# EAGLE design espi (EAGLE 7.2.0)
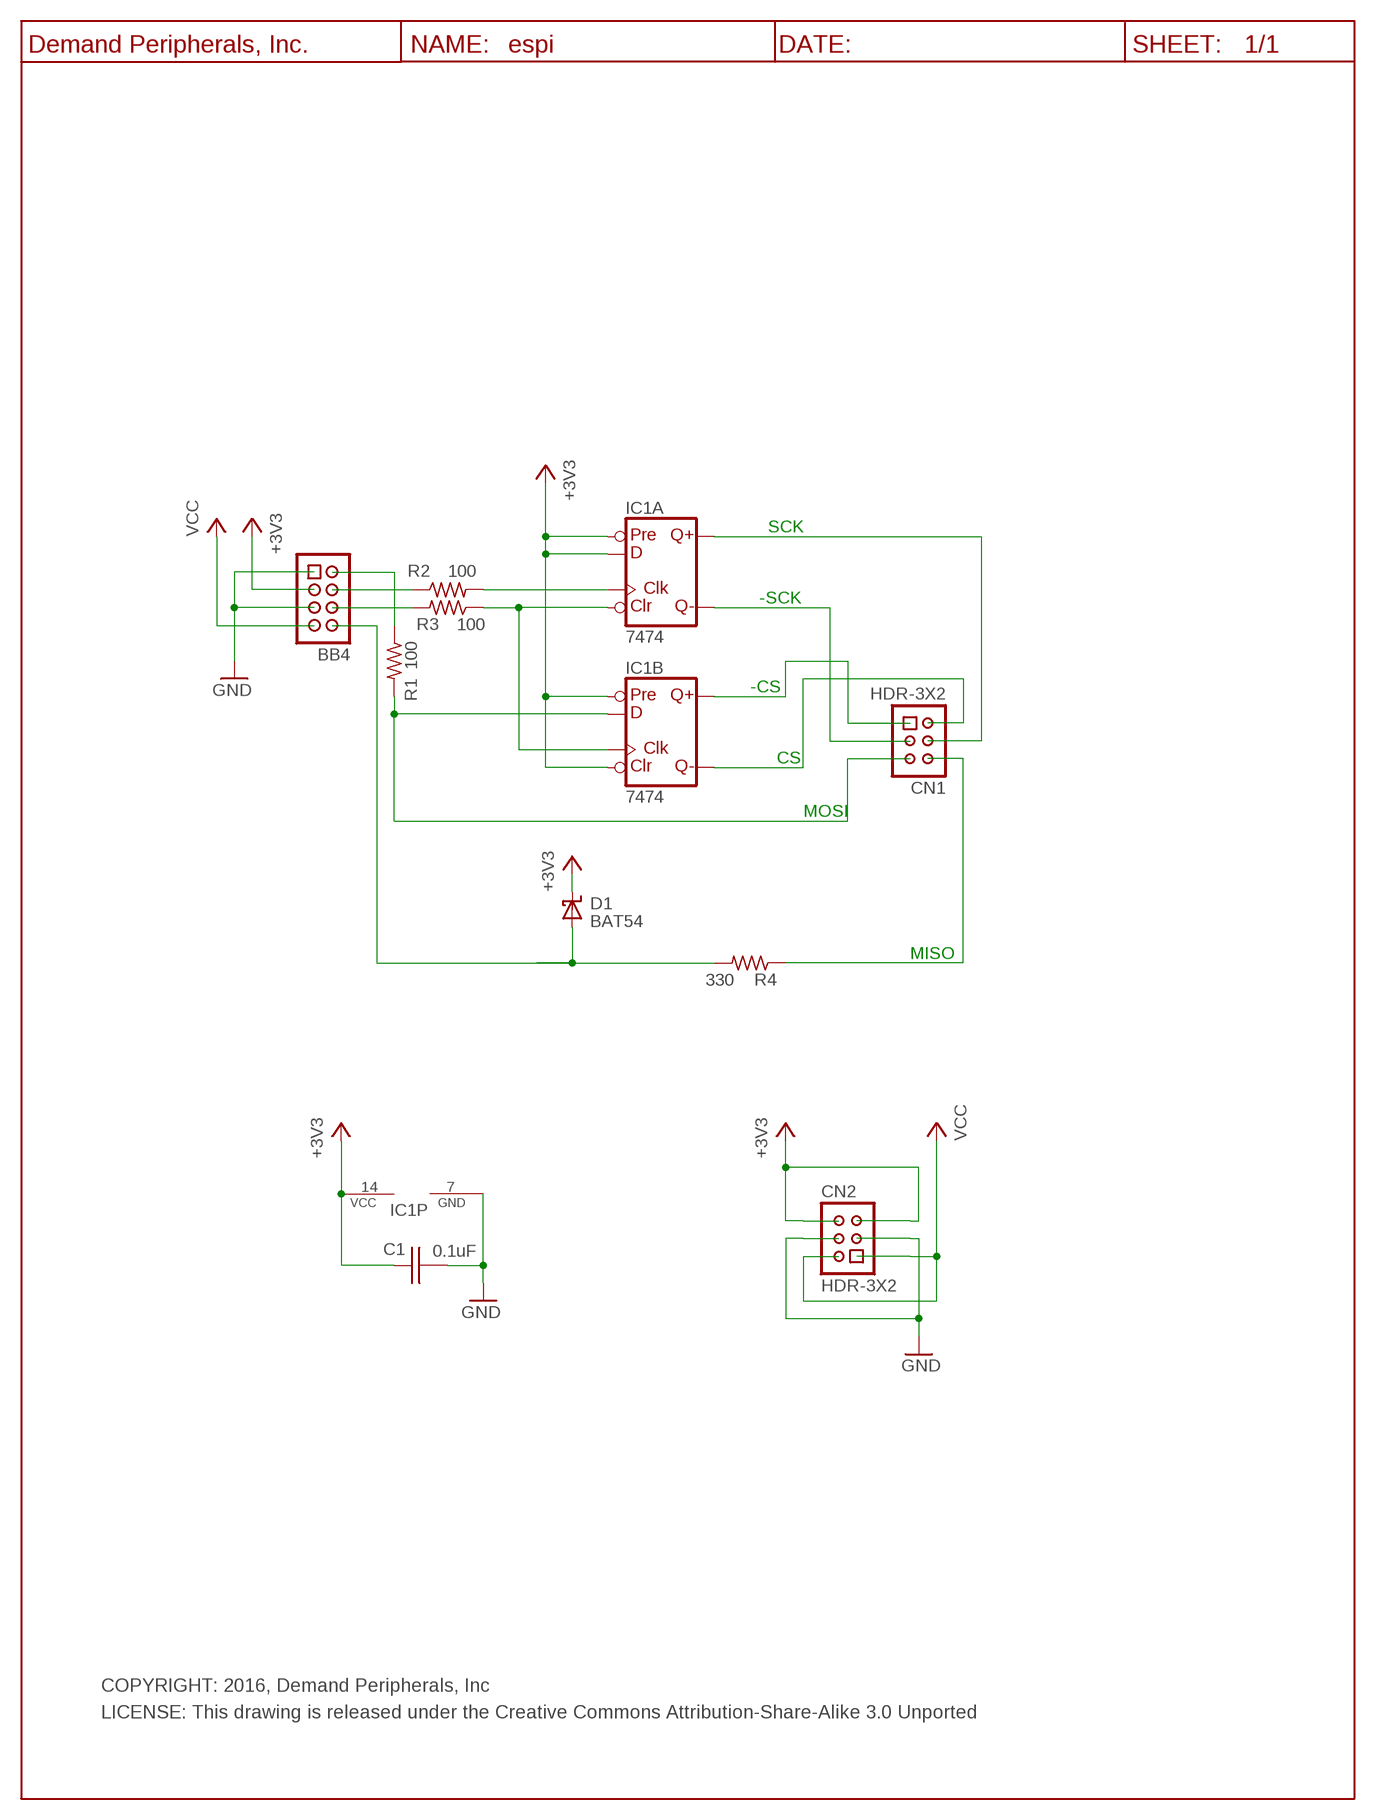
[diagram p0: schematic, sheet 1]

## Parts
BB4  BB_CON  HDR-4X2-SHR  [HDR-4X2]
C1  0.1uF  C0.1UF_C0603  [C0603]
CN1  HDR-3X2  [HDR-3X2]
CN2  HDR-3X2  [HDR-3X2]
D1  BAT54  [SOT23]
IC1  7474  74AHC74SS  [SO14]
R1  100  R100_R0603  [R0603]
R2  100  R100_R0603  [R0603]
R3  100  R100_R0603  [R0603]
R4  330  R330_R0603  [R0603]
U$3  DP_FRAME_P  [P_FRAME]

## Nets
+3V3: BB4.3 C1.1 CN2.5 CN2.6 D1.3(CC) IC1.2(A:D) IC1.4(A:PRE) IC1.10(B:PRE) IC1.13(B:CLR) IC1.14(P:VCC)
GND: BB4.1 BB4.5 C1.2 CN2.3 CN2.4 IC1.7(P:GND)
N$1: CN1.2 IC1.8(B:!Q)
N$2: BB4.8 D1.1(A) R4.2
N$4: CN1.1 IC1.9(B:Q)
N$5: CN1.4 IC1.5(A:Q)
N$6: CN1.3 IC1.6(A:!Q)
N$7: CN1.6 R4.1
N$13: IC1.1(A:CLR) IC1.11(B:CLK) R3.1
N$14: BB4.4 R2.1
N$15: CN1.5 IC1.12(B:D) R1.2
N$16: IC1.3(A:CLK) R2.2
N$19: BB4.6 R3.2
N$20: BB4.2 R1.1
VCC: BB4.7 CN2.1 CN2.2

## Notes on the sheet
- SCK
- -SCK
- -CS
- CS
- MOSI
- MISO
- COPYRIGHT: 2016, Demand Peripherals, Inc
- LICENSE: This drawing is released under the Creative Commons Attribution-Share-Alike 3.0 Unported

## Library data of the parts
BB4 = dpi-conn:HDR-4X2-SHR: Shrouded 4x2 pin header; VENDOR: Digikey; VENDOR-PART-NUM: 609-3530-ND
C1 = dpi-passive:C0.1UF_: 0.1 uF Capacitor, 25V, X7R; VENDOR: Digikey; VENDOR-PART-NUM: 1276-1126-2-ND
CN1 CN2 = dpi-conn:HDR-3X2: Unshrouded 3x2 header with 0.1 inch pitch; VENDOR: Digikey; VENDOR-PART-NUM: 952-2120-ND
D1 = dpi-diopto:BAT54: Schottky Diode; VENDOR: Digikey; VENDOR-PART-NUM: DB3Y313KELCT-ND
IC1 = dpi-transic:74AHC74: Dual D type positive edge triggered FLIP FLOP, preset and clear; VENDOR: Digikey; VENDOR-PART-NUM: 568-4458-1-ND
R1-R3 = dpi-passive:R100_: 100 Ohm resistor, 1%, 0.1 watt; VENDOR: Digikey; VENDOR-PART-NUM: 311-100HRTR-ND
R4 = dpi-passive:R330_: 330 Ohm resistor, 1%, 0.1 watt; VENDOR: Digikey; VENDOR-PART-NUM: 311-330HRTR-ND
U$3 = dpi-sym:DP_FRAME_P: Portrait/Letter Document Frame

## Board
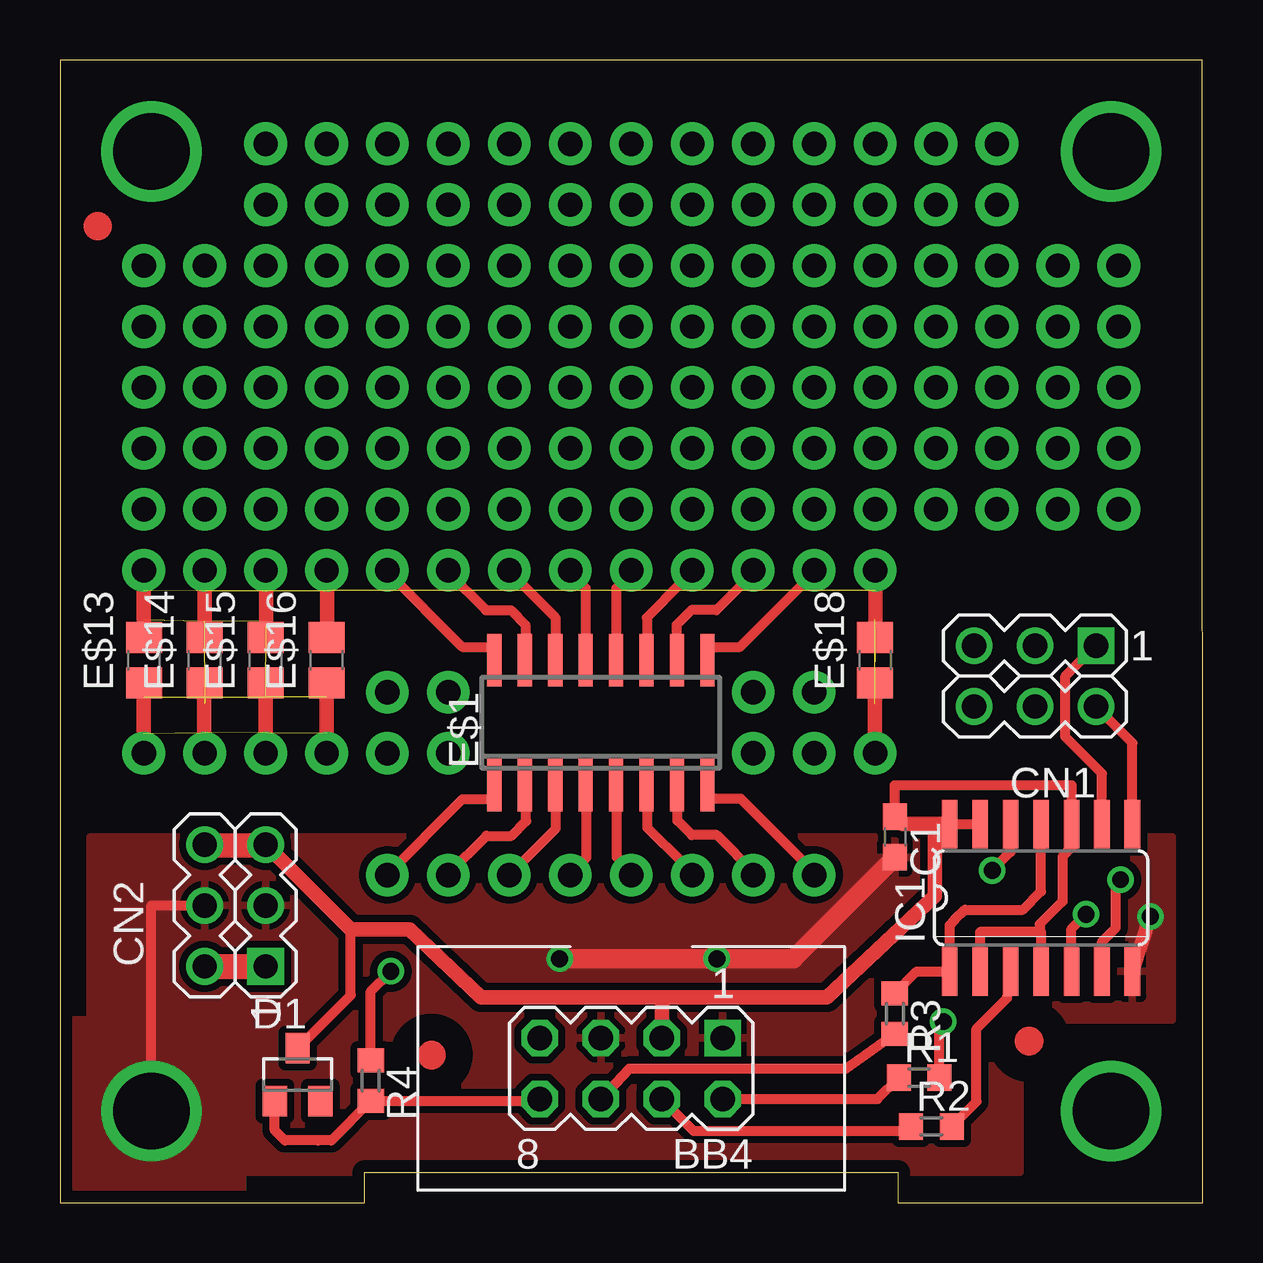
[diagram p1: board, top side]
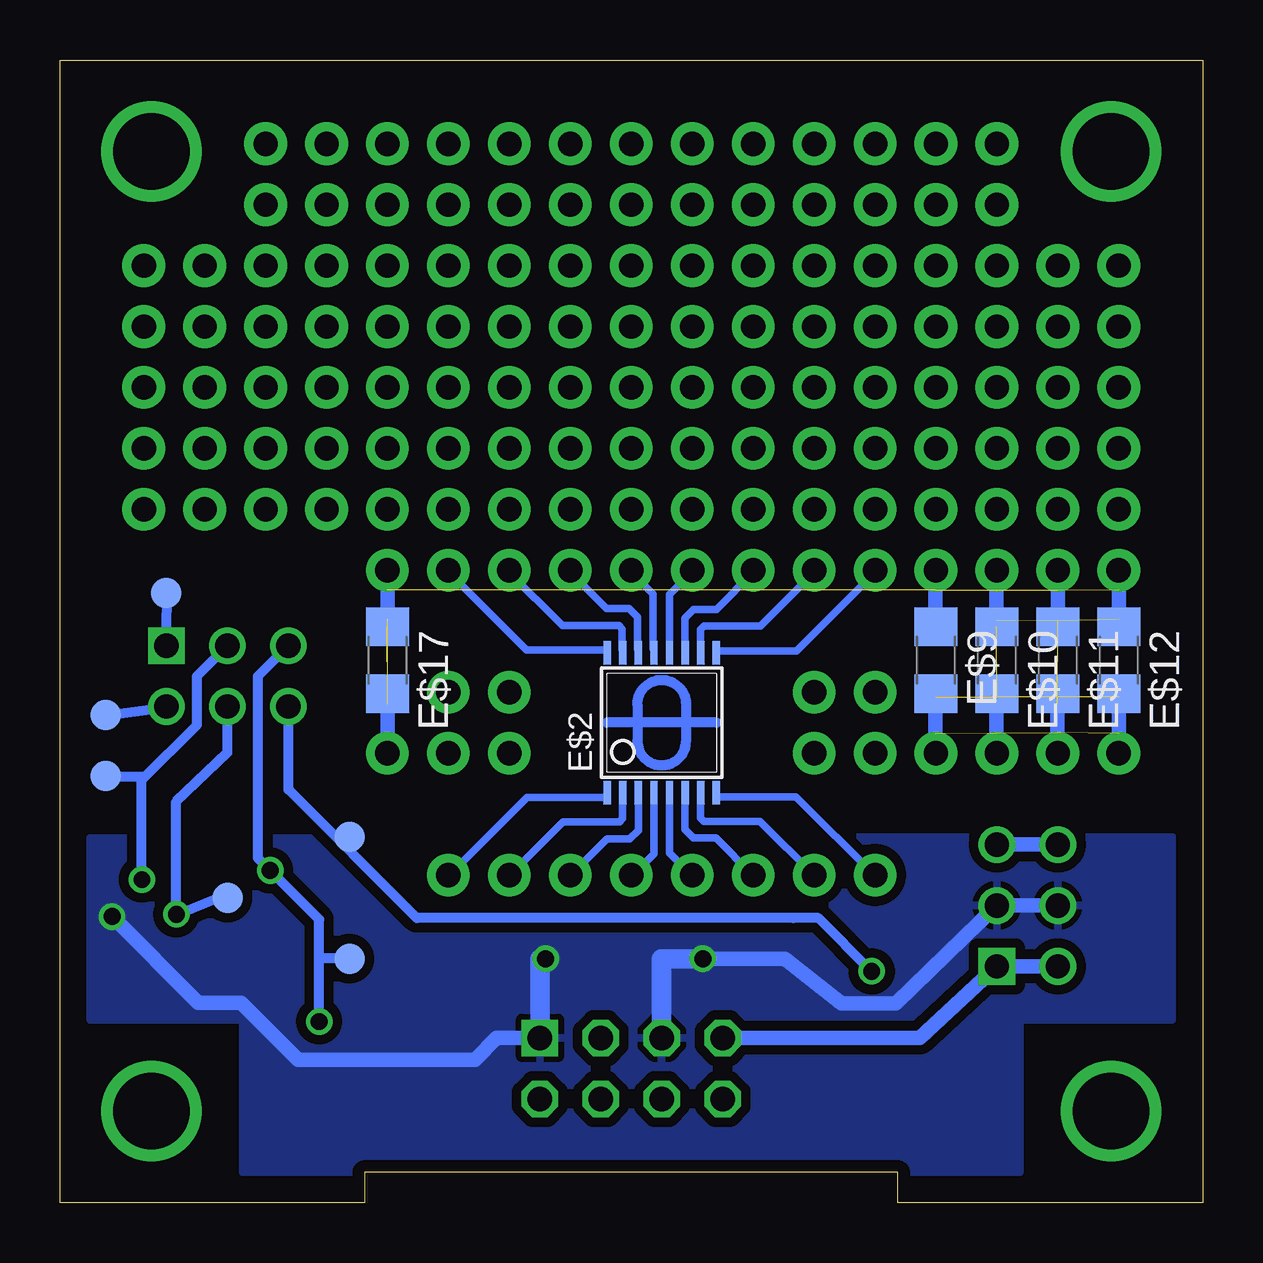
[diagram p2: board, bottom side, seen from below]

Size 47.62 x 47.62 mm. Coordinates in mm from the lower left corner, seen from the top.
Outline: 0,0 12.7,0 12.7,1.27 34.92,1.27 34.92,0 47.62,0 47.61,47.62 0,47.62 0,0
Copper layers (1*16): Top 0.035mm / dielectric 1.5mm / Bottom 0.035mm
Design rules "default *": minimum track width 10mil, minimum drill 24mil, track to track 12mil, track to pad 12mil, pad to pad 12mil, via to via 12mil, smd to smd 10mil, copper to edge 20mil, drill to drill 12mil, minimum pad ring 10mil, minimum via ring 8mil, stop-mask expansion 4mil, vias tented up to drill 29mil, thermal gap 10mil
tKeepout: area 15.1,1 to 32.5,9.7

### Footprints (pad centres in the part's own frame; a part is rotated, then mirrored left to right if it is on the bottom)
HDR-4X2 = drill 1.016 square: 1 -3.81,-1.27 | drill 1.016 octagon: 2 -3.81,1.27; 3 -1.27,-1.27; 4 -1.27,1.27; 5 1.27,-1.27; 6 1.27,1.27; 7 3.81,-1.27; 8 3.81,1.27
C0603 = smd 1.1 x 1: 1 -0.85,0; 2 0.85,0
HDR-3X2 = drill 1.016 square: 1 -2.54,-1.27 | drill 1.016: 2 -2.54,1.27; 3 0,-1.27; 4 0,1.27; 5 2.54,-1.27; 6 2.54,1.27
SOT23 = smd 1.016 x 1.27: 1 -0.95,-1.1; 2 0.95,-1.1; 3 0,1.1
SO16 = smd 0.6 x 2.2: 1 -4.445,-2.6; 2 -3.175,-2.6; 3 -1.905,-2.6; 4 -0.635,-2.6; 5 0.635,-2.6; 6 1.905,-2.6; 7 3.175,-2.6; 8 4.445,-2.6; 9 4.445,2.6; 10 3.175,2.6; 11 1.905,2.6; 12 0.635,2.6; 13 -0.635,2.6; 14 -1.905,2.6; 15 -3.175,2.6; 16 -4.445,2.6
TSSOP16 = smd 0.305 x 0.991: 1 -2.275,-2.918; 2 -1.625,-2.918; 3 -0.975,-2.918; 4 -0.325,-2.918; 5 0.325,-2.918; 6 0.975,-2.918; 7 1.625,-2.918; 8 2.275,-2.918; 9 2.275,2.918; 10 1.625,2.918; 11 0.975,2.918; 12 0.325,2.918; 13 -0.325,2.918; 14 -0.975,2.918; 15 -1.625,2.918; 16 -2.275,2.918
TEST-POINT = smd 1.27 x 1.27: P1 0,0
C1206 = smd 1.6 x 1.8: 1 -1.4,0; 2 1.4,0
C0805 = smd 1.3 x 1.5: 1 -0.95,0; 2 0.95,0
SO14 = smd 0.66 x 2.032: 1 -3.81,-3.073; 2 -2.54,-3.073; 3 -1.27,-3.073; 4 0,-3.073; 5 1.27,-3.073; 6 2.54,-3.073; 7 3.81,-3.073; 8 3.81,3.073; 9 2.54,3.073; 10 1.27,3.073; 11 0,3.073; 12 -1.27,3.073; 13 -2.54,3.073; 14 -3.81,3.073
R0603 = smd 1 x 1.1: 1 -0.85,0; 2 0.85,0

### Placement (x,y rotation side)
BB4  23.81,5.59 180 top
C1  34.8,15.24 270 top
CN1  40.64,21.95 180 top
CN2  7.3,12.38 90 top
D1  9.91,5.33 0 top
E$1  [SO16]  22.54,20 0 top
E$2  [TSSOP16]  22.54,20 0 bottom
E$3  [TEST-POINT]  45.72,17.78 0 bottom
E$4  [TEST-POINT]  35.56,10.16 0 bottom
E$5  [TEST-POINT]  35.56,15.24 0 bottom
E$6  [TEST-POINT]  40.64,12.7 0 bottom
E$7  [TEST-POINT]  43.19,25.4 0 bottom
E$8  [TEST-POINT]  45.72,20.32 0 bottom
E$9  [C1206]  11.11,22.61 270 bottom
E$10  [C1206]  8.57,22.61 270 bottom
E$11  [C1206]  6.03,22.61 270 bottom
E$12  [C1206]  3.49,22.61 270 bottom
E$13  [C0805]  3.51,22.61 90 top
E$14  [C0805]  6.03,22.61 90 top
E$15  [C0805]  8.57,22.61 90 top
E$16  [C0805]  11.11,22.61 90 top
E$17  [C1206]  33.97,22.61 270 bottom
E$18  [C0805]  33.97,22.61 90 top
IC1  40.89,12.7 0 top
R1  35.81,5.21 0 top
R2  36.32,3.17 0 top
R3  34.8,7.87 270 top
R4  12.95,5.08 270 top
U$1  [DPI-1]  22.54,20 270 bottom
U$3  -2.54,-2.54 0 top
U$4  [FIDUCIAL]  15.49,6.15 0 top
U$5  [FIDUCIAL]  40.4,6.73 0 top
U$6  [FIDUCIAL]  1.57,40.7 0 top

### Tracks (layer width: path | path; a pad name or v marks a point on that pad's centre or on a via)
+3V3
  Top 0.406: IC1.2 38.35,11.28 40.84,11.28 | 40.84,11.28 40.89,11.28 IC1.4 | C1.1 34.8,17.4 42.16,17.4 IC1.10 42.16,14.8 41.78,14.41 41.78,12.55 40.84,11.61 40.84,11.28 | IC1.14 IC1.13 | 12.12,11.38 12.12,8.64 D1.3
  Top 0.61: C1.1 35.12,15.77 IC1.14 36.47,15.77 36.47,12.79 31.97,8.56 25.11,8.56 | 25.11,8.56 BB4.3 | 25.11,8.56 17.55,8.56 14.57,11.38 12.12,11.38 CN2.5
  Bottom 0.61: CN2.5 CN2.6
GND  (via drill 0.7, 3.17 pad 3.17)
  Top 0.406: CN2.4 3.81,12.38 v3.81,3.81
  Top 0.61: v45.45,11.93 IC1.7
  Top 0.813: C1.2 30.57,10.16 v27.38,10.16 v20.83,10.16
  Bottom 0.61: v45.45,11.93 41.86,8.33 40.08,8.33 39.37,7.62 37.71,5.96 30.33,5.96 29.43,6.86 BB4.1 | CN2.4 CN2.3 12.78,8.29 15.06,8.29 17.4,10.16 v20.83,10.16
  Bottom 0.813: BB4.1 27.62,10.16 v27.38,10.16 | BB4.5 22.54,10.16 v20.83,10.16
  pour Bottom (isolate 0.406): 1.27,15.24 25.4,15.24 46.35,15.2 46.35,7.62 40.01,7.62 40.01,1.27 8.05,1.26 7.62,1.27 7.62,7.62 1.27,7.62
  pour Top (isolate 0.305): 1.27,15.24 46.35,15.24 46.35,7.62 40.01,7.62 40.01,1.27 7.62,1.27 7.62,0.51 0.51,0.51 0.51,7.62 1.27,7.62
MOUNT  (via drill 3.17 pad 3.17)
  other vias: 43.81,43.81
N$1
  Top 0.406: IC1.8 44.7,19.15 CN1.2
N$2
  Top 0.406: BB4.8 19.58,4.23 R4.2 | R4.2 | R4.2 11.31,2.59 10.74,2.59 9.37,2.59 8.98,2.98 8.96,3.01 D1.1
N$4
  Top 0.406: CN1.1 41.91,21.95 41.91,19.41 43.43,17.88 IC1.9
N$5  (via drill 0.7)
  Top 0.406: IC1.5 42.16,11.4 v42.77,12.01
  Bottom 0.406: v42.77,12.01 42.77,16.71 41.52,17.92 40.64,18.76 CN1.4
N$6  (via drill 0.7)
  Top 0.406: IC1.6 43.43,10.87 44.01,11.44 44.01,13.26 v44.21,13.46
  Bottom 0.406: v44.21,13.46 44.21,17.61 41.91,19.91 41.91,21.95 CN1.3
N$7  (via drill 0.7)
  Top 0.406: R4.1 12.95,8.8 v13.79,9.64
  Bottom 0.406: CN1.6 38.1,17.21 32.75,11.86 17.07,11.86 16.02,11.86 v13.79,9.64
N$8
  Top 0.406: 18.11,16.82 16.79,16.82 13.61,13.64
N$10
  Top 0.406: 19.43,16.84 19.43,15.9 18.82,15.29 17.78,15.29 16.2,13.72
N$11
  Top 0.406: 20.68,16.56 20.68,15.6 19.2,14.12
N$13
  Top 0.406: IC1.11 40.89,12.97 40.13,12.21 37.72,12.21 37.29,11.77 37.08,11.57 IC1.1 35.7,9.63 R3.1
N$14
  Top 0.406: BB4.4 26.42,2.98 29.54,2.98 35.28,2.98 R2.1
N$15  (via drill 0.7)
  Top 0.406: 36.82,7.52 v36.82,7.54 36.66,7.39 R1.2 | v38.86,13.84 39.62,14.61 IC1.12
  Bottom 0.406: v36.82,7.54 36.82,11.8 v38.86,13.84 39.37,14.35 39.37,19.66 39.37,21.95 CN1.5
N$16
  Top 0.406: IC1.3 39.48,8.52 38.2,7.24 38.2,4.21 R2.2
N$17
  Top 0.406: 21.95,16.79 21.95,14.38 21.74,14.17
N$18
  Top 0.406: 27.03,23.16 28.35,23.16 31.52,26.34
N$19
  Top 0.406: BB4.6 23.74,5.59 32.78,5.59 R3.2
N$20
  Top 0.406: BB4.2 34.08,4.32 R1.1
N$23
  Top 0.406: 25.7,23.14 25.7,24.08 26.31,24.69 27.36,24.69 28.93,26.26
N$24
  Top 0.406: 24.46,23.42 24.46,24.38 25.93,25.86
N$31
  Top 0.406: 23.19,23.19 23.19,25.6 23.39,25.81
N$32
  Bottom 0.305: 22.23,16.88 22.23,14.57 21.29,13.63
N$33
  Bottom 0.305: 21.58,16.89 21.58,15.54 21.22,15.19 20.28,15.19 18.73,13.64
N$34
  Bottom 0.305: 20.93,16.92 20.93,16.03 20.79,15.89 18.44,15.89 16.2,13.65
N$35
  Bottom 0.305: 20.27,16.92 16.94,16.92 13.65,13.63
N$36
  Top 0.406: 18.09,23.16 16.76,23.16 13.59,26.34
N$38
  Top 0.406: 19.41,23.14 19.41,24.08 18.8,24.69 17.75,24.69 16.18,26.26
N$39
  Top 0.406: 20.65,23.42 20.65,24.38 19.18,25.86
N$40
  Top 0.406: 21.92,23.19 21.92,25.6 21.72,25.81
N$41
  Top 0.406: 27.05,16.84 28.37,16.84 31.55,13.66
N$42
  Top 0.406: 25.73,16.87 25.73,15.93 26.34,15.32 27.38,15.32 28.96,13.74
N$43
  Top 0.406: 24.49,16.59 24.49,15.62 25.96,14.15
N$44
  Top 0.406: 23.22,16.82 23.22,14.4 23.42,14.2
N$46  (via drill 3.17 pad 3.17)
  other vias: 43.81,3.81
N$47  (via drill 3.17 pad 3.17)
  other vias: 3.81,43.81
N$71
  Bottom 0.305: 22.9,23.06 22.9,25.38 23.84,26.31
N$72
  Bottom 0.305: 23.55,23.05 23.55,24.4 23.9,24.75 24.84,24.75 26.39,26.3
N$73
  Bottom 0.305: 24.19,23.02 24.19,23.91 24.33,24.05 26.68,24.05 28.92,26.29
N$74
  Bottom 0.305: 24.85,23.02 28.18,23.02 31.47,26.31
N$75
  Bottom 0.305: 22.87,16.85 22.87,14.54 23.81,13.6
N$76
  Bottom 0.305: 23.52,16.87 23.52,15.52 23.88,15.16 24.82,15.16 26.36,13.61
N$77
  Bottom 0.305: 24.17,16.89 24.17,16 24.31,15.86 26.66,15.86 28.89,13.63
N$78
  Bottom 0.305: 24.83,16.89 28.16,16.89 31.45,13.6
N$79
  Bottom 0.305: 22.21,23.04 22.21,25.35 21.27,26.29
N$80
  Bottom 0.305: 21.57,23.02 21.57,24.37 21.21,24.73 20.27,24.73 18.72,26.28
N$81
  Bottom 0.305: 20.92,23 20.92,23.89 20.78,24.03 18.43,24.03 16.19,26.26
N$82
  Bottom 0.305: 20.26,23 16.93,23 13.64,26.29
S$1
  Bottom 0.406: 36.04,10.17 36.79,10.17
S$2
  Bottom 0.406: 41.11,12.66 42.48,12.1
S$3
  Bottom 0.406: 45.73,17.77 44.12,17.75
S$4
  Bottom 0.406: 45.74,20.3 43.41,20.61
S$5
  Bottom 0.406: 43.18,25.4 43.19,23.79
S$6  (9 unrouted)
  Bottom 0.61: 11.14,24.28 11.14,25.5 11.12,25.51 | 8.6,24.27 8.6,25.49 | 6.03,24.24 6.03,25.46 | 3.48,24.3 3.48,25.51 | 3.49,19.56 3.49,20.78 | 6.04,19.58 6.04,20.8 | 8.59,19.57 8.59,20.79 | 11.14,19.56 11.14,20.78 | 33.96,24.31 33.96,25.53 | 33.97,19.56 33.97,20.78
S$7  (9 unrouted)
  Top 0.61: 3.48,25.53 3.48,24.02 | 6.03,25.51 6.03,24 | 8.59,25.51 8.59,24 | 11.14,25.53 11.14,24.02 | 11.11,21.07 11.11,19.56 | 8.57,21.07 8.57,19.56 | 6.02,21.07 6.02,19.56 | 3.49,21.07 3.49,19.56 | 33.96,21.07 33.96,19.56 | 33.98,25.53 33.98,24.02
VCC
  Bottom 0.61: BB4.7 11.79,6.87 CN2.1 CN2.2
WW2  (via drill 1.02 pad 1.78)
  other vias: 3.49,18.73
WW5  (via drill 1.02 pad 1.78)
  other vias: 3.49,26.35
WW6  (via drill 1.02 pad 1.78)
  other vias: 3.49,28.89
WW7  (via drill 1.02 pad 1.78)
  other vias: 3.49,31.43
WW8  (via drill 1.02 pad 1.78)
  other vias: 3.49,33.97
WW9  (via drill 1.02 pad 1.78)
  other vias: 3.49,36.51
WW10  (via drill 1.02 pad 1.78)
  other vias: 3.49,39.05
WW15  (via drill 1.02 pad 1.78)
  other vias: 6.03,18.73
WW18  (via drill 1.02 pad 1.78)
  other vias: 6.03,26.35
WW19  (via drill 1.02 pad 1.78)
  other vias: 6.03,28.89
WW20  (via drill 1.02 pad 1.78)
  other vias: 6.03,31.43
WW21  (via drill 1.02 pad 1.78)
  other vias: 6.03,33.97
WW22  (via drill 1.02 pad 1.78)
  other vias: 6.03,36.51
WW23  (via drill 1.02 pad 1.78)
  other vias: 6.03,39.05
WW28  (via drill 1.02 pad 1.78)
  other vias: 8.57,18.73
WW31  (via drill 1.02 pad 1.78)
  other vias: 8.57,26.35
WW32  (via drill 1.02 pad 1.78)
  other vias: 8.57,28.89
WW33  (via drill 1.02 pad 1.78)
  other vias: 8.57,31.43
WW34  (via drill 1.02 pad 1.78)
  other vias: 8.57,33.97
WW35  (via drill 1.02 pad 1.78)
  other vias: 8.57,36.51
WW36  (via drill 1.02 pad 1.78)
  other vias: 8.57,39.05
WW37  (via drill 1.02 pad 1.78)
  other vias: 8.57,41.59
WW38  (via drill 1.02 pad 1.78)
  other vias: 8.57,44.13
WW41  (via drill 1.02 pad 1.78)
  other vias: 11.11,18.73
WW44  (via drill 1.02 pad 1.78)
  other vias: 11.11,26.35
WW45  (via drill 1.02 pad 1.78)
  other vias: 11.11,28.89
WW46  (via drill 1.02 pad 1.78)
  other vias: 11.11,31.43
WW47  (via drill 1.02 pad 1.78)
  other vias: 11.11,33.97
WW48  (via drill 1.02 pad 1.78)
  other vias: 11.11,36.51
WW49  (via drill 1.02 pad 1.78)
  other vias: 11.11,39.05
WW50  (via drill 1.02 pad 1.78)
  other vias: 11.11,41.59
WW51  (via drill 1.02 pad 1.78)
  other vias: 11.11,44.13
WW52  (via drill 1.02 pad 1.78)
  other vias: 13.65,13.65
WW54  (via drill 1.02 pad 1.78)
  other vias: 13.65,18.73
WW55  (via drill 1.02 pad 1.78)
  other vias: 13.65,21.27
WW57  (via drill 1.02 pad 1.78)
  other vias: 13.65,26.35
WW58  (via drill 1.02 pad 1.78)
  other vias: 13.65,28.89
WW59  (via drill 1.02 pad 1.78)
  other vias: 13.65,31.43
WW60  (via drill 1.02 pad 1.78)
  other vias: 13.65,33.97
WW61  (via drill 1.02 pad 1.78)
  other vias: 13.65,36.51
WW62  (via drill 1.02 pad 1.78)
  other vias: 13.65,39.05
WW63  (via drill 1.02 pad 1.78)
  other vias: 13.65,41.59
WW64  (via drill 1.02 pad 1.78)
  other vias: 13.65,44.13
WW65  (via drill 1.02 pad 1.78)
  other vias: 16.19,13.65
WW67  (via drill 1.02 pad 1.78)
  other vias: 16.19,18.73
WW68  (via drill 1.02 pad 1.78)
  other vias: 16.19,21.27
WW70  (via drill 1.02 pad 1.78)
  other vias: 16.19,26.35
WW71  (via drill 1.02 pad 1.78)
  other vias: 16.19,28.89
WW72  (via drill 1.02 pad 1.78)
  other vias: 16.19,31.43
WW73  (via drill 1.02 pad 1.78)
  other vias: 16.19,33.97
WW74  (via drill 1.02 pad 1.78)
  other vias: 16.19,36.51
WW75  (via drill 1.02 pad 1.78)
  other vias: 16.19,39.05
WW76  (via drill 1.02 pad 1.78)
  other vias: 16.19,41.59
WW77  (via drill 1.02 pad 1.78)
  other vias: 16.19,44.13
WW78  (via drill 1.02 pad 1.78)
  other vias: 18.73,13.65
WW83  (via drill 1.02 pad 1.78)
  other vias: 18.73,26.35
WW84  (via drill 1.02 pad 1.78)
  other vias: 18.73,28.89
WW85  (via drill 1.02 pad 1.78)
  other vias: 18.73,31.43
WW86  (via drill 1.02 pad 1.78)
  other vias: 18.73,33.97
WW87  (via drill 1.02 pad 1.78)
  other vias: 18.73,36.51
WW88  (via drill 1.02 pad 1.78)
  other vias: 18.73,39.05
WW89  (via drill 1.02 pad 1.78)
  other vias: 18.73,41.59
WW90  (via drill 1.02 pad 1.78)
  other vias: 18.73,44.13
WW91  (via drill 1.02 pad 1.78)
  other vias: 21.27,13.65
WW96  (via drill 1.02 pad 1.78)
  other vias: 21.27,26.35
WW97  (via drill 1.02 pad 1.78)
  other vias: 21.27,28.89
WW98  (via drill 1.02 pad 1.78)
  other vias: 21.27,31.43
WW99  (via drill 1.02 pad 1.78)
  other vias: 21.27,33.97
WW100  (via drill 1.02 pad 1.78)
  other vias: 21.27,36.51
WW101  (via drill 1.02 pad 1.78)
  other vias: 21.27,39.05
WW102  (via drill 1.02 pad 1.78)
  other vias: 21.27,41.59
WW103  (via drill 1.02 pad 1.78)
  other vias: 21.27,44.13
WW104  (via drill 1.02 pad 1.78)
  other vias: 23.81,13.65
WW109  (via drill 1.02 pad 1.78)
  other vias: 23.81,26.35
WW110  (via drill 1.02 pad 1.78)
  other vias: 23.81,28.89
WW111  (via drill 1.02 pad 1.78)
  other vias: 23.81,31.43
WW112  (via drill 1.02 pad 1.78)
  other vias: 23.81,33.97
WW113  (via drill 1.02 pad 1.78)
  other vias: 23.81,36.51
WW114  (via drill 1.02 pad 1.78)
  other vias: 23.81,39.05
WW115  (via drill 1.02 pad 1.78)
  other vias: 23.81,41.59
WW116  (via drill 1.02 pad 1.78)
  other vias: 23.81,44.13
WW117  (via drill 1.02 pad 1.78)
  other vias: 26.35,13.65
WW122  (via drill 1.02 pad 1.78)
  other vias: 26.35,26.35
WW123  (via drill 1.02 pad 1.78)
  other vias: 26.35,28.89
WW124  (via drill 1.02 pad 1.78)
  other vias: 26.35,31.43
WW125  (via drill 1.02 pad 1.78)
  other vias: 26.35,33.97
WW126  (via drill 1.02 pad 1.78)
  other vias: 26.35,36.51
WW127  (via drill 1.02 pad 1.78)
  other vias: 26.35,39.05
WW128  (via drill 1.02 pad 1.78)
  other vias: 26.35,41.59
WW129  (via drill 1.02 pad 1.78)
  other vias: 26.35,44.13
WW130  (via drill 1.02 pad 1.78)
  other vias: 28.89,13.65
WW132  (via drill 1.02 pad 1.78)
  other vias: 28.89,18.73
WW133  (via drill 1.02 pad 1.78)
  other vias: 28.89,21.27
WW135  (via drill 1.02 pad 1.78)
  other vias: 28.89,26.35
WW136  (via drill 1.02 pad 1.78)
  other vias: 28.89,28.89
WW137  (via drill 1.02 pad 1.78)
  other vias: 28.89,31.43
WW138  (via drill 1.02 pad 1.78)
  other vias: 28.89,33.97
WW139  (via drill 1.02 pad 1.78)
  other vias: 28.89,36.51
WW140  (via drill 1.02 pad 1.78)
  other vias: 28.89,39.05
WW141  (via drill 1.02 pad 1.78)
  other vias: 28.89,41.59
WW142  (via drill 1.02 pad 1.78)
  other vias: 28.89,44.13
WW143  (via drill 1.02 pad 1.78)
  other vias: 31.43,13.65
WW145  (via drill 1.02 pad 1.78)
  other vias: 31.43,18.73
WW146  (via drill 1.02 pad 1.78)
  other vias: 31.43,21.27
WW148  (via drill 1.02 pad 1.78)
  other vias: 31.43,26.35
WW149  (via drill 1.02 pad 1.78)
  other vias: 31.43,28.89
WW150  (via drill 1.02 pad 1.78)
  other vias: 31.43,31.43
WW151  (via drill 1.02 pad 1.78)
  other vias: 31.43,33.97
WW152  (via drill 1.02 pad 1.78)
  other vias: 31.43,36.51
WW153  (via drill 1.02 pad 1.78)
  other vias: 31.43,39.05
WW154  (via drill 1.02 pad 1.78)
  other vias: 31.43,41.59
WW155  (via drill 1.02 pad 1.78)
  other vias: 31.43,44.13
WW158  (via drill 1.02 pad 1.78)
  other vias: 33.97,18.73
WW161  (via drill 1.02 pad 1.78)
  other vias: 33.97,26.35
WW162  (via drill 1.02 pad 1.78)
  other vias: 33.97,28.89
WW163  (via drill 1.02 pad 1.78)
  other vias: 33.97,31.43
WW164  (via drill 1.02 pad 1.78)
  other vias: 33.97,33.97
WW165  (via drill 1.02 pad 1.78)
  other vias: 33.97,36.51
WW166  (via drill 1.02 pad 1.78)
  other vias: 33.97,39.05
WW167  (via drill 1.02 pad 1.78)
  other vias: 33.97,41.59
WW168  (via drill 1.02 pad 1.78)
  other vias: 33.97,44.13
WW175  (via drill 1.02 pad 1.78)
  other vias: 36.51,28.89
WW176  (via drill 1.02 pad 1.78)
  other vias: 36.51,31.43
WW177  (via drill 1.02 pad 1.78)
  other vias: 36.51,33.97
WW178  (via drill 1.02 pad 1.78)
  other vias: 36.51,36.51
WW179  (via drill 1.02 pad 1.78)
  other vias: 36.51,39.05
WW180  (via drill 1.02 pad 1.78)
  other vias: 36.51,41.59
WW181  (via drill 1.02 pad 1.78)
  other vias: 36.51,44.13
WW188  (via drill 1.02 pad 1.78)
  other vias: 39.05,28.89
WW189  (via drill 1.02 pad 1.78)
  other vias: 39.05,31.43
WW190  (via drill 1.02 pad 1.78)
  other vias: 39.05,33.97
WW191  (via drill 1.02 pad 1.78)
  other vias: 39.05,36.51
WW192  (via drill 1.02 pad 1.78)
  other vias: 39.05,39.05
WW193  (via drill 1.02 pad 1.78)
  other vias: 39.05,41.59
WW194  (via drill 1.02 pad 1.78)
  other vias: 39.05,44.13
WW201  (via drill 1.02 pad 1.78)
  other vias: 41.59,28.89
WW202  (via drill 1.02 pad 1.78)
  other vias: 41.59,31.43
WW203  (via drill 1.02 pad 1.78)
  other vias: 41.59,33.97
WW204  (via drill 1.02 pad 1.78)
  other vias: 41.59,36.51
WW205  (via drill 1.02 pad 1.78)
  other vias: 41.59,39.05
WW214  (via drill 1.02 pad 1.78)
  other vias: 44.13,28.89
WW215  (via drill 1.02 pad 1.78)
  other vias: 44.13,31.43
WW216  (via drill 1.02 pad 1.78)
  other vias: 44.13,33.97
WW217  (via drill 1.02 pad 1.78)
  other vias: 44.13,36.51
WW218  (via drill 1.02 pad 1.78)
  other vias: 44.13,39.05
(copper drawn outside any net)
  shapes: Top area x2

### Text on the board
tTest: 1.875 Inches | 1.575 Inches | (C) 2019 Demand Peripherals, Inc. | ESPI, Rev 19A | -CK | -CS | MO | MI | CK | CS | 3.3 | C1 | 1.575 Inches | 1.875 Inches | IC1 | Gnd | 5.0 | BB4 | R3 | R1 | R2 | R4 | D1